# EAGLE schematic gf12_v2 (EAGLE 9.5.2)
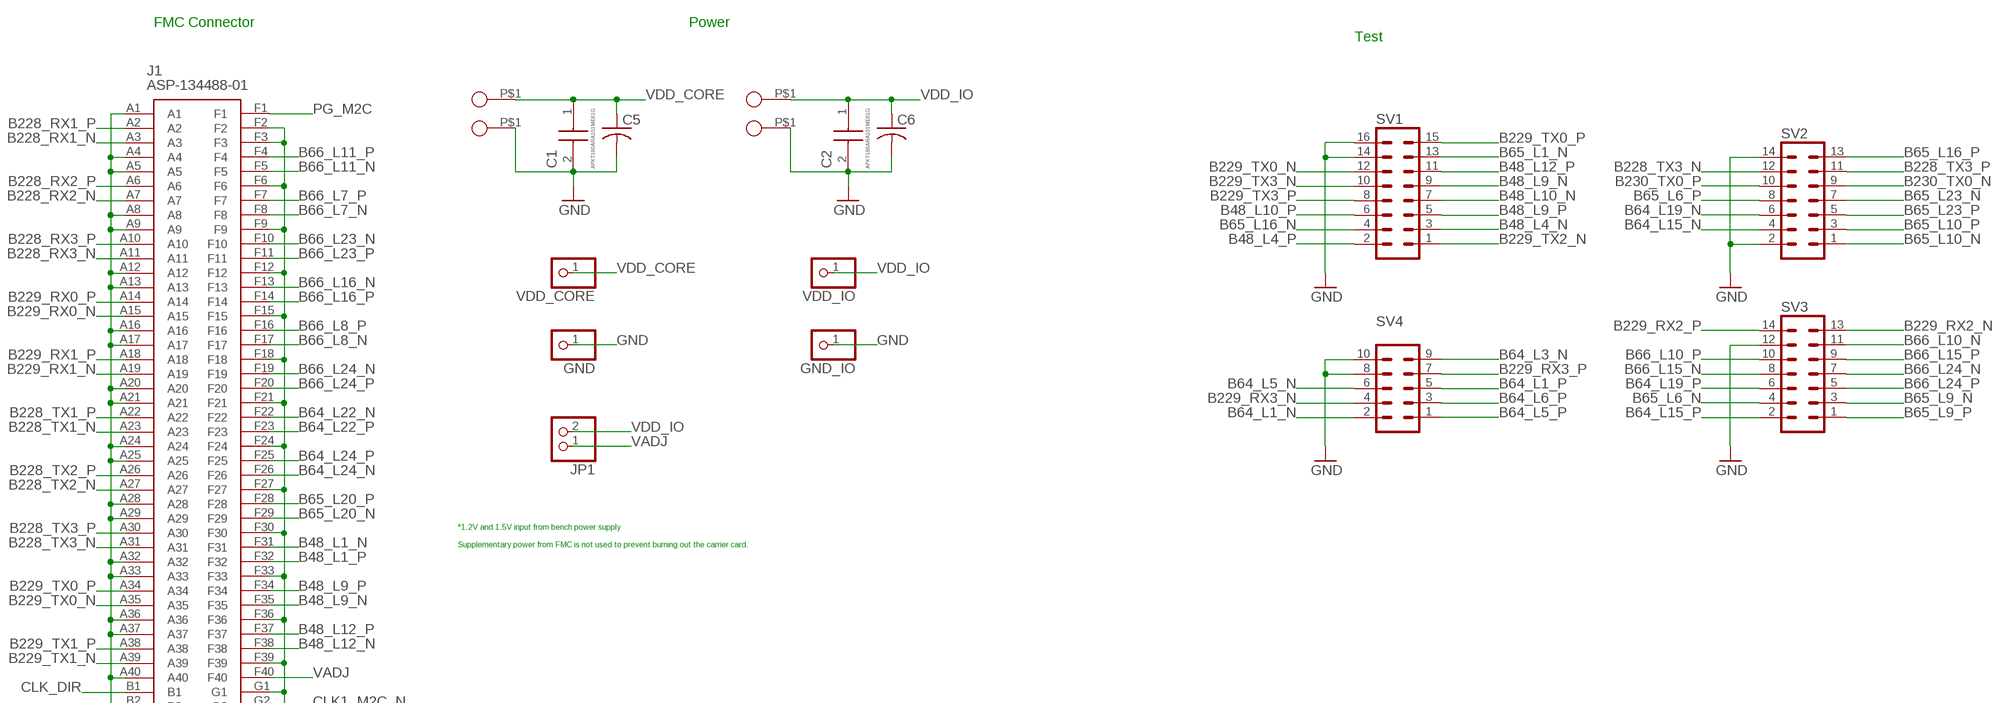
[diagram p0: schematic, sheet 1, part 1 of 3]
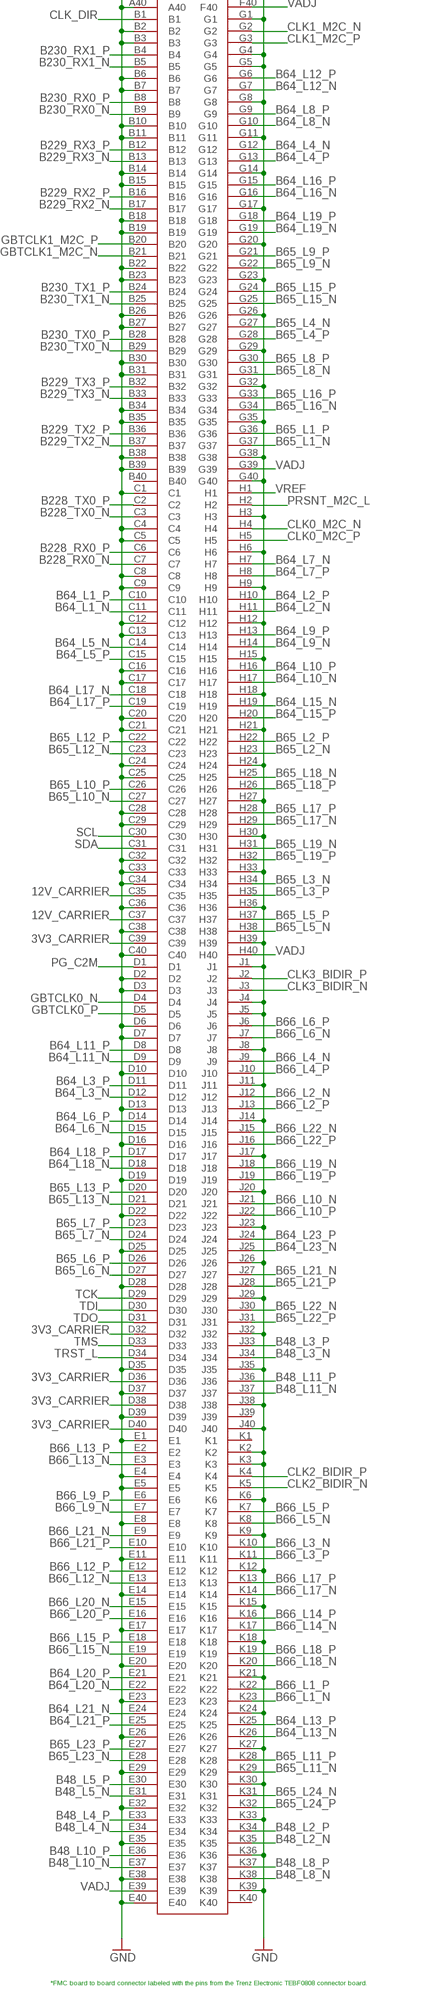
[diagram p1: schematic, sheet 1, part 2 of 3]
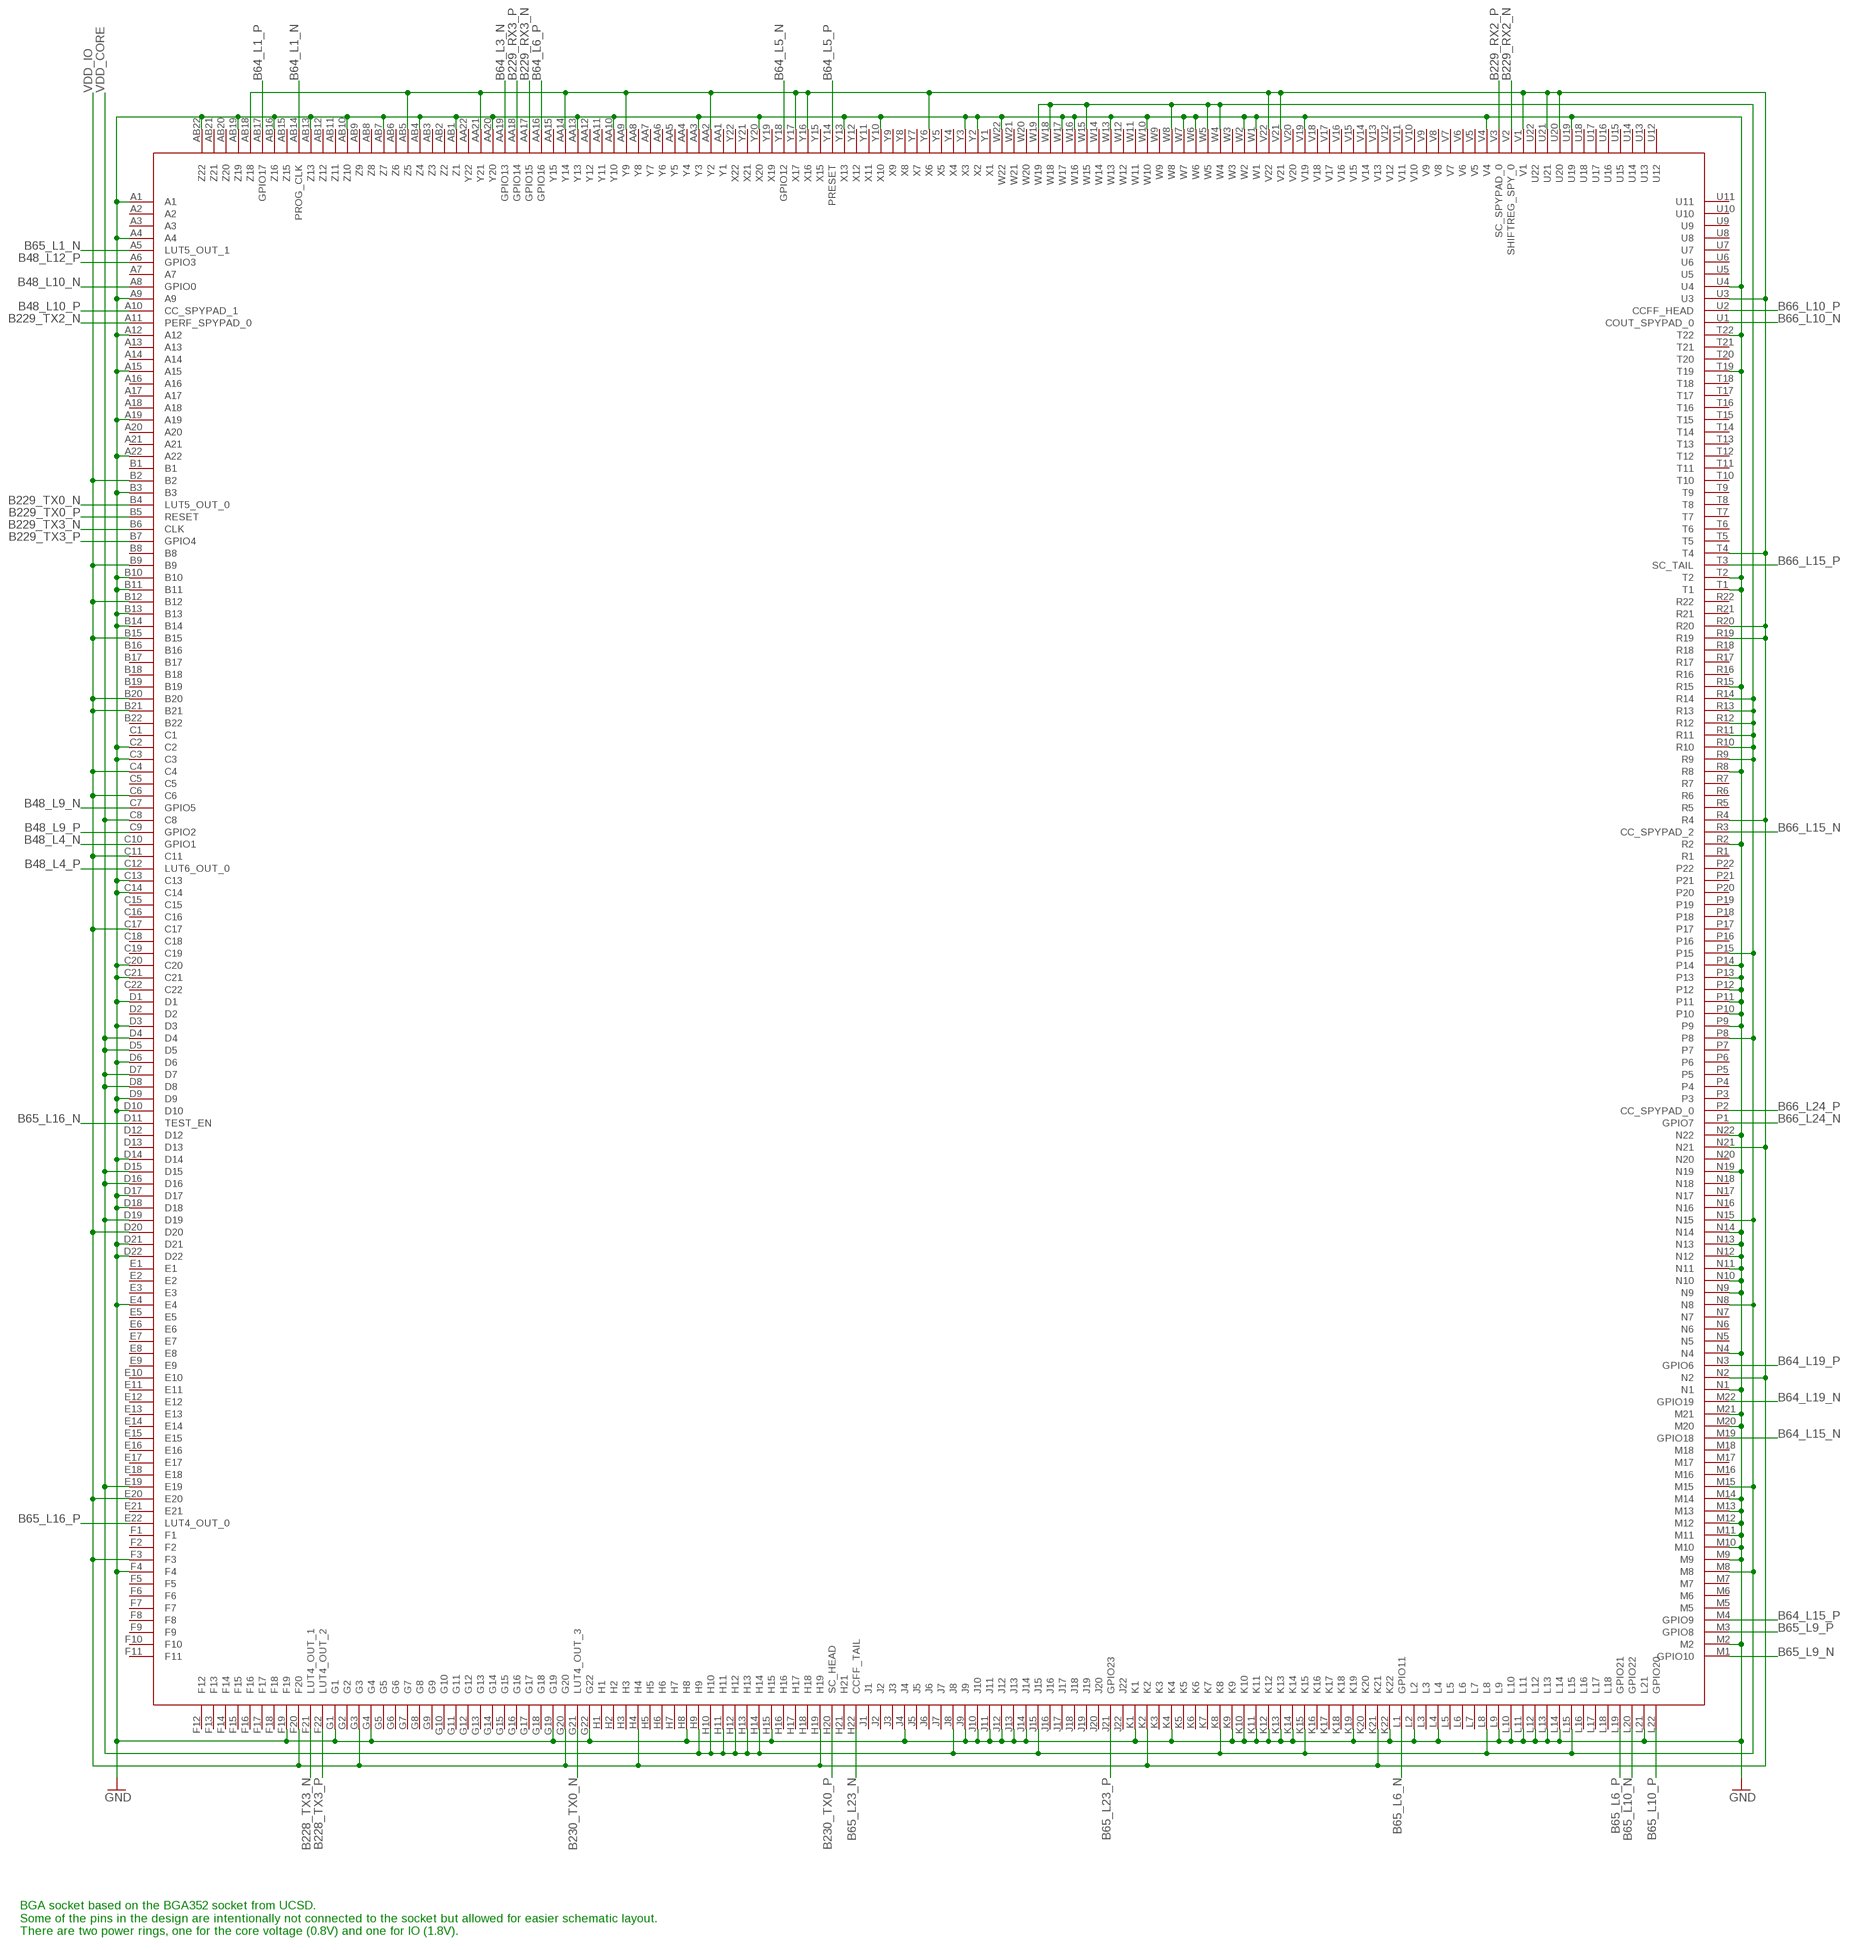
[diagram p2: schematic, sheet 1, part 3 of 3]

## Parts
C1  APXT160ARA101ME61G  [CAPAE530X610N]
C2  APXT160ARA101ME61G  [CAPAE530X610N]
C5  C-USC0805K  [C0805K]
C6  C-USC0805K  [C0805K]
GND  PINHD-1X1  [1X01]
GND_IO  PINHD-1X1  [1X01]
J1  ASP-134488-01  [ASP13448801]
JP1  PINHD-1X2  [1X02]
SV1  MA08-2  [MA08-2]
SV2  MA07-2  [MA07-2]
SV3  MA07-2  [MA07-2]
SV4  MA05-2  [MA05-2]
U$2  BGA352  [BGA484C100P22X22_2400X2400X220N]
U$3  BANANA_JACK  [73099]
U$4  BANANA_JACK  [73099]
U$5  BANANA_JACK  [73099]
VDD  BANANA_JACK  [73099]
VDD_CORE  PINHD-1X1  [1X01]
VDD_IO  PINHD-1X1  [1X01]

## Nets
3V3_CARRIER: J1.C39 J1.D32 J1.D36 J1.D38 J1.D40
12V_CARRIER: J1.C35 J1.C37
B48_L1_N: J1.F31
B48_L1_P: J1.F32
B48_L2_N: J1.K35
B48_L2_P: J1.K34
B48_L3_N: J1.J34
B48_L3_P: J1.J33
B48_L4_N: J1.E34 SV1.3 U$2.C10(GPIO1)
B48_L4_P: J1.E33 SV1.2 U$2.C12(LUT6_OUT_0)
B48_L5_N: J1.E31
B48_L5_P: J1.E30
B48_L8_N: J1.K38
B48_L8_P: J1.K37
B48_L9_N: J1.F35 SV1.9 U$2.C7(GPIO5)
B48_L9_P: J1.F34 SV1.5 U$2.C9(GPIO2)
B48_L10_N: J1.E37 SV1.7 U$2.A8(GPIO0)
B48_L10_P: J1.E36 SV1.6 U$2.A10(CC_SPYPAD_1)
B48_L11_N: J1.J37
B48_L11_P: J1.J36
B48_L12_N: J1.F38
B48_L12_P: J1.F37 SV1.11 U$2.A6(GPIO3)
B64_L1_N: J1.C11 SV4.2 U$2.AB14(PROG_CLK)
B64_L1_P: J1.C10 SV4.5 U$2.AB17(GPIO17)
B64_L2_N: J1.H11
B64_L2_P: J1.H10
B64_L3_N: J1.D12 SV4.9 U$2.AA19(GPIO13)
B64_L3_P: J1.D11
B64_L4_N: J1.G12
B64_L4_P: J1.G13
B64_L5_N: J1.C14 SV4.6 U$2.Y18(GPIO12)
B64_L5_P: J1.C15 SV4.1 U$2.Y14(PRESET)
B64_L6_N: J1.D15
B64_L6_P: J1.D14 SV4.3 U$2.AA16(GPIO16)
B64_L7_N: J1.H7
B64_L7_P: J1.H8
B64_L8_N: J1.G10
B64_L8_P: J1.G9
B64_L9_N: J1.H14
B64_L9_P: J1.H13
B64_L10_N: J1.H17
B64_L10_P: J1.H16
B64_L11_N: J1.D9
B64_L11_P: J1.D8
B64_L12_N: J1.G7
B64_L12_P: J1.G6
B64_L13_N: J1.K26
B64_L13_P: J1.K25
B64_L15_N: J1.H19 SV2.4 U$2.M19(GPIO18)
B64_L15_P: J1.H20 SV3.2 U$2.M4(GPIO9)
B64_L16_N: J1.G16
B64_L16_P: J1.G15
B64_L17_N: J1.C18
B64_L17_P: J1.C19
B64_L18_N: J1.D18
B64_L18_P: J1.D17
B64_L19_N: J1.G19 SV2.6 U$2.M22(GPIO19)
B64_L19_P: J1.G18 SV3.6 U$2.N3(GPIO6)
B64_L20_N: J1.E22
B64_L20_P: J1.E21
B64_L21_N: J1.E24
B64_L21_P: J1.E25
B64_L22_N: J1.F22
B64_L22_P: J1.F23
B64_L23_N: J1.J25
B64_L23_P: J1.J24
B64_L24_N: J1.F26
B64_L24_P: J1.F25
B65_L1_N: J1.G37 SV1.13 U$2.A5(LUT5_OUT_1)
B65_L1_P: J1.G36
B65_L2_N: J1.H23
B65_L2_P: J1.H22
B65_L3_N: J1.H34
B65_L3_P: J1.H35
B65_L4_N: J1.G27
B65_L4_P: J1.G28
B65_L5_N: J1.H38
B65_L5_P: J1.H37
B65_L6_N: J1.D27 SV3.4 U$2.L1(GPIO11)
B65_L6_P: J1.D26 SV2.8 U$2.L19(GPIO21)
B65_L7_N: J1.D24
B65_L7_P: J1.D23
B65_L8_N: J1.G31
B65_L8_P: J1.G30
B65_L9_N: J1.G22 SV3.3 U$2.M1(GPIO10)
B65_L9_P: J1.G21 SV3.1 U$2.M3(GPIO8)
B65_L10_N: J1.C27 SV2.1 U$2.L20(GPIO22)
B65_L10_P: J1.C26 SV2.3 U$2.L22(GPIO20)
B65_L11_N: J1.K29
B65_L11_P: J1.K28
B65_L12_N: J1.C23
B65_L12_P: J1.C22
B65_L13_N: J1.D21
B65_L13_P: J1.D20
B65_L15_N: J1.G25
B65_L15_P: J1.G24
B65_L16_N: J1.G34 SV1.4 U$2.D11(TEST_EN)
B65_L16_P: J1.G33 SV2.13 U$2.E22(LUT4_OUT_0)
B65_L17_N: J1.H29
B65_L17_P: J1.H28
B65_L18_N: J1.H25
B65_L18_P: J1.H26
B65_L19_N: J1.H31
B65_L19_P: J1.H32
B65_L20_N: J1.F29
B65_L20_P: J1.F28
B65_L21_N: J1.J27
B65_L21_P: J1.J28
B65_L22_N: J1.J30
B65_L22_P: J1.J31
B65_L23_N: J1.E28 SV2.7 U$2.H22(CCFF_TAIL)
B65_L23_P: J1.E27 SV2.5 U$2.J21(GPIO23)
B65_L24_N: J1.K31
B65_L24_P: J1.K32
B66_L1_N: J1.K23
B66_L1_P: J1.K22
B66_L2_N: J1.J12
B66_L2_P: J1.J13
B66_L3_N: J1.K10
B66_L3_P: J1.K11
B66_L4_N: J1.J9
B66_L4_P: J1.J10
B66_L5_N: J1.K8
B66_L5_P: J1.K7
B66_L6_N: J1.J7
B66_L6_P: J1.J6
B66_L7_N: J1.F8
B66_L7_P: J1.F7
B66_L8_N: J1.F17
B66_L8_P: J1.F16
B66_L9_N: J1.E7
B66_L9_P: J1.E6
B66_L10_N: J1.J21 SV3.11 U$2.U1(COUT_SPYPAD_0)
B66_L10_P: J1.J22 SV3.10 U$2.U2(CCFF_HEAD)
B66_L11_N: J1.F5
B66_L11_P: J1.F4
B66_L12_N: J1.E13
B66_L12_P: J1.E12
B66_L13_N: J1.E3
B66_L13_P: J1.E2
B66_L14_N: J1.K17
B66_L14_P: J1.K16
B66_L15_N: J1.E19 SV3.8 U$2.R3(CC_SPYPAD_2)
B66_L15_P: J1.E18 SV3.9 U$2.T3(SC_TAIL)
B66_L16_N: J1.F13
B66_L16_P: J1.F14
B66_L17_N: J1.K14
B66_L17_P: J1.K13
B66_L18_N: J1.K20
B66_L18_P: J1.K19
B66_L19_N: J1.J18
B66_L19_P: J1.J19
B66_L20_N: J1.E15
B66_L20_P: J1.E16
B66_L21_N: J1.E9
B66_L21_P: J1.E10
B66_L22_N: J1.J15
B66_L22_P: J1.J16
B66_L23_N: J1.F10
B66_L23_P: J1.F11
B66_L24_N: J1.F19 SV3.7 U$2.P1(GPIO7)
B66_L24_P: J1.F20 SV3.5 U$2.P2(CC_SPYPAD_0)
B228_RX0_N: J1.C7
B228_RX0_P: J1.C6
B228_RX1_N: J1.A3
B228_RX1_P: J1.A2
B228_RX2_N: J1.A7
B228_RX2_P: J1.A6
B228_RX3_N: J1.A11
B228_RX3_P: J1.A10
B228_TX0_N: J1.C3
B228_TX0_P: J1.C2
B228_TX1_N: J1.A23
B228_TX1_P: J1.A22
B228_TX2_N: J1.A27
B228_TX2_P: J1.A26
B228_TX3_N: J1.A31 SV2.12 U$2.F21(LUT4_OUT_1)
B228_TX3_P: J1.A30 SV2.11 U$2.F22(LUT4_OUT_2)
B229_RX0_N: J1.A15
B229_RX0_P: J1.A14
B229_RX1_N: J1.A19
B229_RX1_P: J1.A18
B229_RX2_N: J1.B17 SV3.13 U$2.V2(SHIFTREG_SPY_0)
B229_RX2_P: J1.B16 SV3.14 U$2.V3(SC_SPYPAD_0)
B229_RX3_N: J1.B13 SV4.4 U$2.AA17(GPIO15)
B229_RX3_P: J1.B12 SV4.7 U$2.AA18(GPIO14)
B229_TX0_N: J1.A35 SV1.12 U$2.B4(LUT5_OUT_0)
B229_TX0_P: J1.A34 SV1.15 U$2.B5(RESET)
B229_TX1_N: J1.A39
B229_TX1_P: J1.A38
B229_TX2_N: J1.B37 SV1.1 U$2.A11(PERF_SPYPAD_0)
B229_TX2_P: J1.B36
B229_TX3_N: J1.B33 SV1.10 U$2.B6(CLK)
B229_TX3_P: J1.B32 SV1.8 U$2.B7(GPIO4)
B230_RX0_N: J1.B9
B230_RX0_P: J1.B8
B230_RX1_N: J1.B5
B230_RX1_P: J1.B4
B230_TX0_N: J1.B29 SV2.9 U$2.G21(LUT4_OUT_3)
B230_TX0_P: J1.B28 SV2.10 U$2.H20(SC_HEAD)
B230_TX1_N: J1.B25
B230_TX1_P: J1.B24
CLK0_M2C_N: J1.H4
CLK0_M2C_P: J1.H5
CLK1_M2C_N: J1.G2
CLK1_M2C_P: J1.G3
CLK2_BIDIR_N: J1.K5
CLK2_BIDIR_P: J1.K4
CLK3_BIDIR_N: J1.J3
CLK3_BIDIR_P: J1.J2
CLK_DIR: J1.B1
GBTCLK0_N: J1.D4
GBTCLK0_P: J1.D5
GBTCLK1_M2C_N: J1.B21
GBTCLK1_M2C_P: J1.B20
GND: C1.2(-) C2.2(-) C5.2 C6.2 GND.1 GND_IO.1 J1.A1 J1.A4 J1.A5 J1.A8 J1.A9 J1.A12 J1.A13 J1.A16 J1.A17 J1.A20 J1.A21 J1.A24 J1.A25 J1.A28 J1.A29 J1.A32 J1.A33 J1.A36 J1.A37 J1.A40 J1.B2 J1.B3 J1.B6 J1.B7 J1.B10 J1.B11 J1.B14 J1.B15 J1.B18 J1.B19 J1.B22 J1.B23 J1.B26 J1.B27 J1.B30 J1.B31 J1.B34 J1.B35 J1.B38 J1.B39 J1.C1 J1.C4 J1.C5 J1.C8 J1.C9 J1.C12 J1.C13 J1.C16 J1.C17 J1.C20 J1.C21 J1.C24 J1.C25 J1.C28 J1.C29 J1.C32 J1.C33 J1.C34 J1.C36 J1.C38 J1.C40 J1.D2 J1.D3 J1.D6 J1.D7 J1.D10 J1.D13 J1.D16 J1.D19 J1.D22 J1.D25 J1.D28 J1.D35 J1.D37 J1.D39 J1.E1 J1.E4 J1.E5 J1.E8 J1.E11 J1.E14 J1.E17 J1.E20 J1.E23 J1.E26 J1.E29 J1.E32 J1.E35 J1.E38 J1.E40 J1.F2 J1.F3 J1.F6 J1.F9 J1.F12 J1.F15 J1.F18 J1.F21 J1.F24 J1.F27 J1.F30 J1.F33 J1.F36 J1.F39 J1.G1 J1.G4 J1.G5 J1.G8 J1.G11 J1.G14 J1.G17 J1.G20 J1.G23 J1.G26 J1.G29 J1.G32 J1.G35 J1.G38 J1.G40 J1.H3 J1.H6 J1.H9 J1.H12 J1.H15 J1.H18 J1.H21 J1.H24 J1.H27 J1.H30 J1.H33 J1.H36 J1.H39 J1.J1 J1.J4 J1.J5 J1.J8 J1.J11 J1.J14 J1.J17 J1.J20 J1.J23 J1.J26 J1.J29 J1.J32 J1.J35 J1.J38 J1.J40 J1.K2 J1.K3 J1.K6 J1.K9 J1.K12 J1.K15 J1.K18 J1.K21 J1.K24 J1.K27 J1.K30 J1.K33 J1.K36 J1.K39 SV1.14 SV1.16 SV2.2 SV2.14 SV3.12 SV4.8 SV4.10 U$2.A1 U$2.A4 U$2.A9 U$2.A12 U$2.A15 U$2.A19 U$2.A22 U$2.AA3(Y3) U$2.AA10(Y10) U$2.AA13(Y13) U$2.AA20(Y20) U$2.AB1(Z1) U$2.AB4(Z4) U$2.AB7(Z7) U$2.AB10(Z10) U$2.AB13(Z13) U$2.AB16(Z16) U$2.AB19(Z19) U$2.AB22(Z22) U$2.B3 U$2.B10 U$2.B11 U$2.B13 U$2.B14 U$2.C2 U$2.C3 U$2.C13 U$2.C14 U$2.C20 U$2.C21 U$2.D1 U$2.D3 U$2.D6 U$2.D9 U$2.D10 U$2.D14 U$2.D17 U$2.D18 U$2.D21 U$2.D22 U$2.E4 U$2.F4 U$2.F19 U$2.G1 U$2.G4 U$2.G19 U$2.G22 U$2.H8 U$2.H15 U$2.J4 U$2.J9 U$2.J10 U$2.J11 U$2.J12 U$2.J13 U$2.J14 U$2.K1 U$2.K4 U$2.K9 U$2.K10 U$2.K11 U$2.K12 U$2.K13 U$2.K14 U$2.K19 U$2.K22 U$2.L2 U$2.L4 U$2.L9 U$2.L10 U$2.L11 U$2.L12 U$2.L13 U$2.L14 U$2.L21 U$2.M2 U$2.M9 U$2.M10 U$2.M11 U$2.M12 U$2.M13 U$2.M14 U$2.M20 U$2.M21 U$2.N1 U$2.N4 U$2.N9 U$2.N10 U$2.N11 U$2.N12 U$2.N13 U$2.N14 U$2.N19 U$2.N22 U$2.P9 U$2.P10 U$2.P11 U$2.P12 U$2.P13 U$2.P14 U$2.R2 U$2.R8 U$2.R15 U$2.T1 U$2.T2 U$2.T19 U$2.T22 U$2.U4 U$2.U19 U$2.V4 U$2.V19 U$2.W1 U$2.W2 U$2.W6 U$2.W7 U$2.W10 U$2.W13 U$2.W16 U$2.W17 U$2.W22 U$2.Y2(X2) U$2.Y3(X3) U$2.Y10(X10) U$2.Y13(X13) U$2.Y20(X20) U$3.P$1 U$5.P$1
PG_C2M: J1.D1
PG_M2C: J1.F1
PRSNT_M2C_L: J1.H2
SCL: J1.C30
SDA: J1.C31
TCK: J1.D29
TDI: J1.D30
TDO: J1.D31
TMS: J1.D33
TRST_L: J1.D34
VADJ: J1.E39 J1.F40 J1.G39 J1.H40 JP1.1
VDD_CORE: C1.1(+) C5.1 U$2.C8 U$2.D4 U$2.D5 U$2.D7 U$2.D8 U$2.D15 U$2.D16 U$2.D19 U$2.E19 U$2.H9 U$2.H10 U$2.H11 U$2.H12 U$2.H13 U$2.H14 U$2.J8 U$2.J15 U$2.K8 U$2.K15 U$2.L8 U$2.L15 U$2.M8 U$2.M15 U$2.N8 U$2.N15 U$2.P8 U$2.P15 U$2.R9 U$2.R10 U$2.R11 U$2.R12 U$2.R13 U$2.R14 U$2.W4 U$2.W5 U$2.W8 U$2.W15 U$2.W18 U$2.W19 VDD.P$1 VDD_CORE.1
VDD_IO: C2.1(+) C6.1 JP1.2 U$2.AA2(Y2) U$2.AA9(Y9) U$2.AA14(Y14) U$2.AA21(Y21) U$2.AB5(Z5) U$2.AB18(Z18) U$2.B2 U$2.B9 U$2.B12 U$2.B15 U$2.B20 U$2.B21 U$2.C4 U$2.C6 U$2.C11 U$2.C17 U$2.D20 U$2.E20 U$2.F3 U$2.F20 U$2.G3 U$2.G20 U$2.H4 U$2.H19 U$2.K2 U$2.K21 U$2.N2 U$2.N21 U$2.R4 U$2.R19 U$2.R20 U$2.T4 U$2.U3 U$2.U20 U$2.U21 U$2.V1 U$2.V21 U$2.V22 U$2.Y6(X6) U$2.Y16(X16) U$2.Y17(X17) U$4.P$1 VDD_IO.1
VREF: J1.H1
Unconnected: J1.B40 J1.J39 J1.K1 J1.K40 U$2.A2 U$2.A3 U$2.A7 U$2.A13 U$2.A14 U$2.A16 U$2.A17 U$2.A18 U$2.A20 U$2.A21 U$2.AA1(Y1) U$2.AA4(Y4) U$2.AA5(Y5) U$2.AA6(Y6) U$2.AA7(Y7) U$2.AA8(Y8) U$2.AA11(Y11) U$2.AA12(Y12) U$2.AA15(Y15) U$2.AA22(Y22) U$2.AB2(Z2) U$2.AB3(Z3) U$2.AB6(Z6) U$2.AB8(Z8) U$2.AB9(Z9) U$2.AB11(Z11) U$2.AB12(Z12) U$2.AB15(Z15) U$2.AB20(Z20) U$2.AB21(Z21) U$2.B1 U$2.B8 U$2.B16 U$2.B17 U$2.B18 U$2.B19 U$2.B22 U$2.C1 U$2.C5 U$2.C15 U$2.C16 U$2.C18 U$2.C19 U$2.C22 U$2.D2 U$2.D12 U$2.D13 U$2.E1 U$2.E2 U$2.E3 U$2.E5 U$2.E6 U$2.E7 U$2.E8 U$2.E9 U$2.E10 U$2.E11 U$2.E12 U$2.E13 U$2.E14 U$2.E15 U$2.E16 U$2.E17 U$2.E18 U$2.E21 U$2.F1 U$2.F2 U$2.F5 U$2.F6 U$2.F7 U$2.F8 U$2.F9 U$2.F10 U$2.F11 U$2.F12 U$2.F13 U$2.F14 U$2.F15 U$2.F16 U$2.F17 U$2.F18 U$2.G2 U$2.G5 U$2.G6 U$2.G7 U$2.G8 U$2.G9 U$2.G10 U$2.G11 U$2.G12 U$2.G13 U$2.G14 U$2.G15 U$2.G16 U$2.G17 U$2.G18 U$2.H1 U$2.H2 U$2.H3 U$2.H5 U$2.H6 U$2.H7 U$2.H16 U$2.H17 U$2.H18 U$2.H21 U$2.J1 U$2.J2 U$2.J3 U$2.J5 U$2.J6 U$2.J7 U$2.J16 U$2.J17 U$2.J18 U$2.J19 U$2.J20 U$2.J22 U$2.K3 U$2.K5 U$2.K6 U$2.K7 U$2.K16 U$2.K17 U$2.K18 U$2.K20 U$2.L3 U$2.L5 U$2.L6 U$2.L7 U$2.L16 U$2.L17 U$2.L18 U$2.M5 U$2.M6 U$2.M7 U$2.M16 U$2.M17 U$2.M18 U$2.N5 U$2.N6 U$2.N7 U$2.N16 U$2.N17 U$2.N18 U$2.N20 U$2.P3 U$2.P4 U$2.P5 U$2.P6 U$2.P7 U$2.P16 U$2.P17 U$2.P18 U$2.P19 U$2.P20 U$2.P21 U$2.P22 U$2.R1 U$2.R5 U$2.R6 U$2.R7 U$2.R16 U$2.R17 U$2.R18 U$2.R21 U$2.R22 U$2.T5 U$2.T6 U$2.T7 U$2.T8 U$2.T9 U$2.T10 U$2.T11 U$2.T12 U$2.T13 U$2.T14 U$2.T15 U$2.T16 U$2.T17 U$2.T18 U$2.T20 U$2.T21 U$2.U5 U$2.U6 U$2.U7 U$2.U8 U$2.U9 U$2.U10 U$2.U11 U$2.U12 U$2.U13 U$2.U14 U$2.U15 U$2.U16 U$2.U17 U$2.U18 U$2.U22 U$2.V5 U$2.V6 U$2.V7 U$2.V8 U$2.V9 U$2.V10 U$2.V11 U$2.V12 U$2.V13 U$2.V14 U$2.V15 U$2.V16 U$2.V17 U$2.V18 U$2.V20 U$2.W3 U$2.W9 U$2.W11 U$2.W12 U$2.W14 U$2.W20 U$2.W21 U$2.Y1(X1) U$2.Y4(X4) U$2.Y5(X5) U$2.Y7(X7) U$2.Y8(X8) U$2.Y9(X9) U$2.Y11(X11) U$2.Y12(X12) U$2.Y15(X15) U$2.Y19(X19) U$2.Y21(X21) U$2.Y22(X22)

## Notes on the sheet
- FMC Connector | Power
- Test
- *1.2V and 1.5V input from bench power supply
  
  Supplementary power from FMC is not used to prevent burning out the carrier card.
- BGA socket based on the BGA352 socket from UCSD. 
  Some of the pins in the design are intentionally not connected to the socket but allowed for easier schematic layout.
  There are two power rings, one for the core voltage (0.8V) and one for IO (1.8V).
- *FMC board to board connector labeled with the pins from the Trenz Electronic TEBF0808 connector board.

## Power pins joined to a net without a drawn wire
GND: U$3.P$2(GND) U$3.P$3(GND) U$3.P$4(GND) U$3.P$5(GND) U$4.P$2(GND) U$4.P$3(GND) U$4.P$4(GND) U$4.P$5(GND) U$5.P$2(GND) U$5.P$3(GND) U$5.P$4(GND) U$5.P$5(GND) VDD.P$2(GND) VDD.P$3(GND) VDD.P$4(GND) VDD.P$5(GND)

## Library data of the parts
C1 C2 = SamacSys_Parts:APXT160ARA101ME61G: Aluminum Organic Polymer Capacitors 100uF 16V Source: Datasheet; DESCRIPTION: Aluminum Organic Polymer Capacitors 100uF 16V; HEIGHT: 6.1mm; MANUFACTURER_NAME: United Chemi-Con; MANUFACTURER_PART_NUMBER: APXT160ARA101ME61G; MOUSER_PART_NUMBER: 661-APXT160A101ME61G; MOUSER_PRICE-STOCK: https://www.mouser.co.uk/ProductDetail/United-Chemi-Con/APXT160ARA101ME61G?qs=GBLSl2Akirsip577GuQBxg%3D%3D
C5 C6 = rcl:C-US: CAPACITOR, American symbol; SPICEPREFIX: C
GND GND_IO VDD_CORE VDD_IO = pinhead:PINHD-1X1: PIN HEADER
J1 = SamacSys_Parts:ASP-134488-01: SAMTEC - ASP-134488-01 - CONN, VITA 57 FMC, HEADER, 400POS, 10ROW Source: Datasheet <http://suddendocs.samtec.com/prints/asp-134488-01-mkt.pdf>; DESCRIPTION: SAMTEC - ASP-134488-01 - CONN, VITA 57 FMC, HEADER, 400POS, 10ROW; HEIGHT: 7.11mm; MANUFACTURER_NAME: SAMTEC; MANUFACTURER_PART_NUMBER: ASP-134488-01; MOUSER_PART_NUMBER: 200-ASP-134488-01; MOUSER_PRICE-STOCK: https://www.mouser.co.uk/ProductDetail/Samtec/ASP-134488-01?qs=jyzYFa4oMQiB2Frr%252B13AUg%3D%3D
JP1 = pinhead:PINHD-1X2: PIN HEADER
SV1 = con-lstb:MA08-2: PIN HEADER; OC_FARNELL: unknown; OC_NEWARK: unknown
SV2 SV3 = con-lstb:MA07-2: PIN HEADER; OC_FARNELL: unknown; OC_NEWARK: unknown
SV4 = con-lstb:MA05-2: PIN HEADER; OC_FARNELL: unknown; OC_NEWARK: unknown
U$2 = BGA352:BGA352
U$3-U$5 VDD = 73099:BANANA_JACK